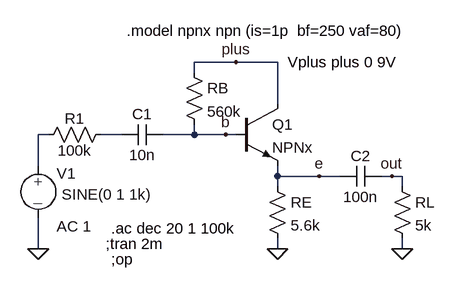
[diagram p0: schematic e-folger.asc]
e-folger.asc, the LTspice schematic file:
Version 4
SHEET 1 880 680
WIRE 144 80 80 80
WIRE 208 80 144 80
WIRE 80 96 80 80
WIRE 208 144 208 80
WIRE -144 192 -160 192
WIRE -32 192 -64 192
WIRE 80 192 80 176
WIRE 80 192 32 192
WIRE 128 192 80 192
WIRE 144 192 128 192
WIRE -160 240 -160 192
WIRE 208 256 208 240
WIRE 272 256 208 256
WIRE 304 256 272 256
WIRE 384 256 368 256
WIRE 400 256 384 256
WIRE 208 272 208 256
WIRE 400 272 400 256
WIRE -160 368 -160 320
WIRE 208 368 208 352
WIRE 400 368 400 352
FLAG 208 368 0
FLAG 272 256 e
FLAG 128 192 b
FLAG 144 80 plus
FLAG -160 368 0
FLAG 400 368 0
FLAG 384 256 out
SYMBOL EIT_Semiconductors\\npn 144 144 R0
SYMATTR InstName Q1
SYMATTR Value NPNx
SYMBOL res 192 256 R0
SYMATTR InstName RE
SYMATTR Value 5.6k
SYMBOL res 64 80 R0
SYMATTR InstName RB
SYMATTR Value 560k
SYMBOL cap -32 208 R270
WINDOW 0 32 32 VTop 2
WINDOW 3 0 32 VBottom 2
SYMATTR InstName C1
SYMATTR Value 10n
SYMBOL res -160 208 R270
WINDOW 0 25 56 VTop 2
WINDOW 3 7 56 VBottom 2
SYMATTR InstName R1
SYMATTR Value 100k
SYMBOL source-V -160 224 R0
WINDOW 3 36 60 Left 2
WINDOW 123 28 109 Left 2
WINDOW 39 0 0 Left 2
SYMATTR InstName V1
SYMATTR Value SINE(0 1 1k)
SYMATTR Value2 AC 1
SYMBOL cap 304 272 R270
WINDOW 0 32 32 VTop 2
WINDOW 3 0 32 VBottom 2
SYMATTR InstName C2
SYMATTR Value 100n
SYMBOL res 384 256 R0
SYMATTR InstName RL
SYMATTR Value 5k
TEXT -24 32 Left 2 !.model npnx npn (is=1p  bf=250 vaf=80)
TEXT 224 80 Left 2 !Vplus plus 0 9V
TEXT -48 384 Left 2 !;op
TEXT -48 336 Left 2 !.ac dec 20 1 100k
TEXT -56 360 Left 2 !;tran 2m

The netlist it stands for:
* e-folger.asc
Q1 plus b e 0 NPNx
RE e 0 5.6k
RB plus b 560k
C1 N002 b 10n
R1 N001 N002 100k
V1 N001 0 SINE(0 1 1k) AC 1
C2 e out 100n
RL out 0 5k
.model NPN NPN
.model PNP PNP
.lib standard.bjt
.model npnx npn (is=1p  bf=250 vaf=80)
Vplus plus 0 9V
;op
.ac dec 20 1 100k
;tran 2m
.backanno
.end